# Altium project VCU-BMS_Tester.PrjPCB (part 2 of 2)

## Sheet Connectors.SchDoc
size B; Organization: Altium Limited; Address1: L3, 12a Rodborough Rd; Address2: Frenchs Forest; Address3: NSW; Address4: Australia 2086; SheetNumber: 7
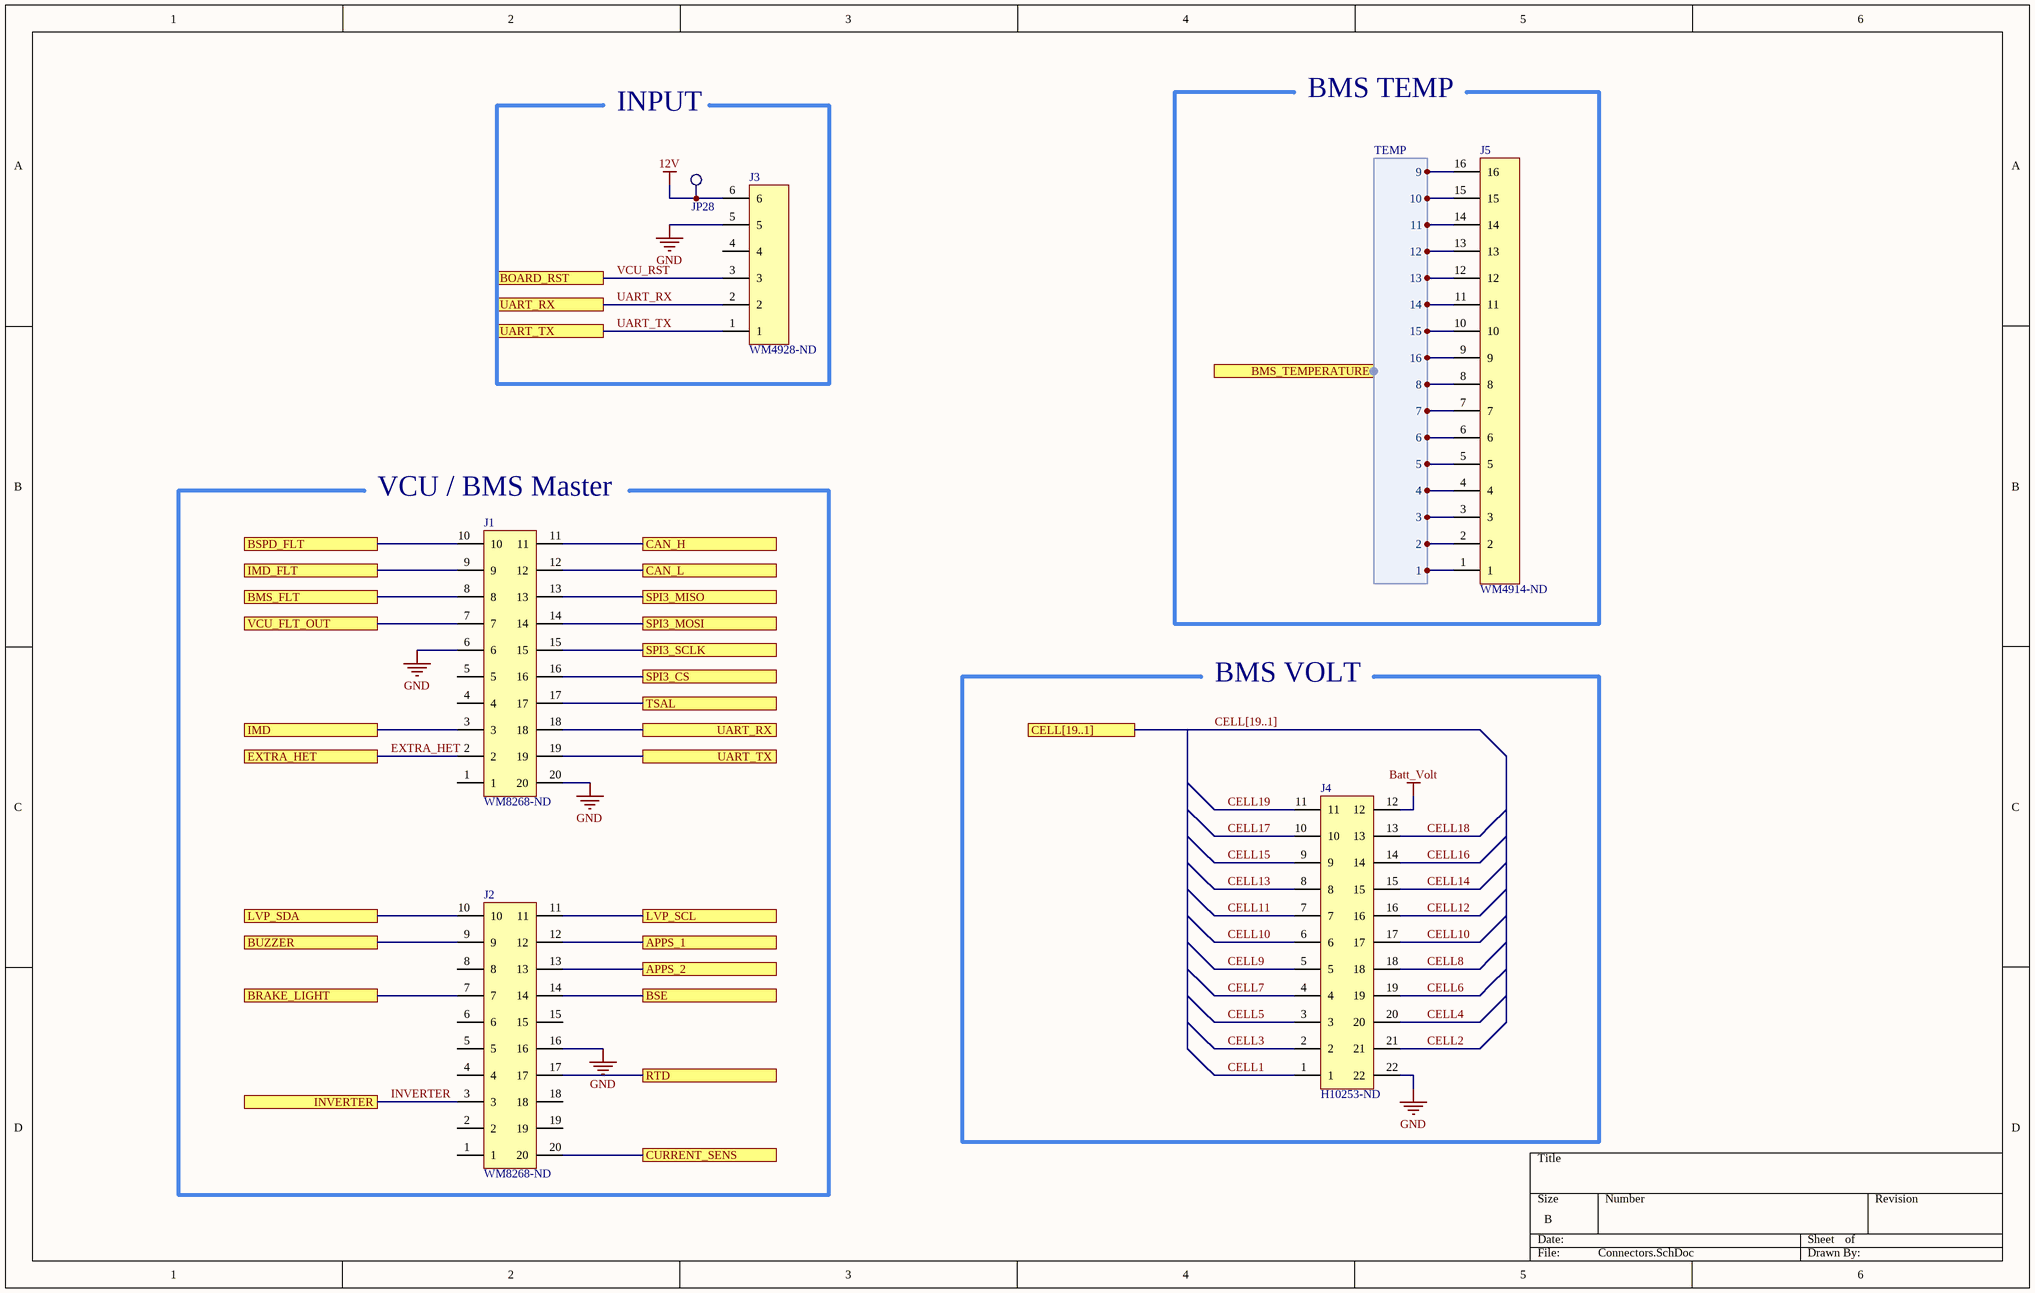
[diagram p4: Connectors.SchDoc]

### Parts
J1  WM8268-ND  [2X10PIN]
J2  WM8268-ND  [2X10PIN]
J3  WM4928-ND  [6PIN]
J4  H10253-ND  [2X11PIN]
J5  WM4914-ND  [16PIN]
JP28  Testpoint2  [TP2]  (value not drawn)

### Ports
APPS_1, APPS_2, BMS_FLT, BMS_TEMPERATURE (harness TEMP), BOARD_RST, BRAKE_LIGHT, BSE, BSPD_FLT, BUZZER, CAN_H, CAN_L, CELL[19..1], CURRENT_SENS, EXTRA_HET, IMD, IMD_FLT, INVERTER, LVP_SCL, LVP_SDA, RTD, SPI3_CS, SPI3_MISO, SPI3_MOSI, SPI3_SCLK, TSAL, UART_RX, UART_TX, VCU_FLT_OUT

### Harnesses
TEMP: 1, 2, 3, 4, 5, 6, 7, 8, 16, 15, 14, 13, 12, 11, 10, 9

### Nets
12V: J3.6 JP28.1
Batt_Volt: J4.12
GND: J1.6 J1.20 J2.16 J3.5 J4.22
APPS_1: J2.12 ; port APPS_1
APPS_2: J2.13 ; port APPS_2
BMS_FLT: J1.8 ; port BMS_FLT
BSE: J2.14 ; port BSE
BSPD_FLT: J1.10 ; port BSPD_FLT
CAN_H: J1.11 ; port CAN_H
CAN_L: J1.12 ; port CAN_L
CELL1: J4.1
CELL2: J4.21
CELL3: J4.2
CELL4: J4.20
CELL5: J4.3
CELL6: J4.19
CELL7: J4.4
CELL8: J4.18
CELL9: J4.5
CELL10: J4.6 J4.17
CELL11: J4.7
CELL12: J4.16
CELL13: J4.8
CELL14: J4.15
CELL15: J4.9
CELL16: J4.14
CELL17: J4.10
CELL18: J4.13
CELL19: J4.11
CURRENT_SENS: J2.20 ; port CURRENT_SENS
EXTRA_HET: J1.2 ; port EXTRA_HET
IMD: J1.3 ; port IMD
IMD_FLT: J1.9 ; port IMD_FLT
INVERTER: J2.3 ; port INVERTER
RTD: J2.17 ; port RTD
SCL: J2.11 ; port LVP_SCL
SDA: J2.10 ; port LVP_SDA
SPI3_CLK: J1.15 ; port SPI3_SCLK
SPI3_CS: J1.16 ; port SPI3_CS
SPI3_MISO: J1.13 ; port SPI3_MISO
SPI3_MOSI: J1.14 ; port SPI3_MOSI
TEMP_1: J5.1 ; port BMS_TEMPERATURE.1
TEMP_2: J5.2 ; port BMS_TEMPERATURE.2
TEMP_3: J5.3 ; port BMS_TEMPERATURE.3
TEMP_4: J5.4 ; port BMS_TEMPERATURE.4
TEMP_5: J5.5 ; port BMS_TEMPERATURE.5
TEMP_6: J5.6 ; port BMS_TEMPERATURE.6
TEMP_7: J5.7 ; port BMS_TEMPERATURE.7
TEMP_8: J5.8 ; port BMS_TEMPERATURE.8
TEMP_9: J5.16 ; port BMS_TEMPERATURE.9
TEMP_10: J5.15 ; port BMS_TEMPERATURE.10
TEMP_11: J5.14 ; port BMS_TEMPERATURE.11
TEMP_12: J5.13 ; port BMS_TEMPERATURE.12
TEMP_13: J5.12 ; port BMS_TEMPERATURE.13
TEMP_14: J5.11 ; port BMS_TEMPERATURE.14
TEMP_15: J5.10 ; port BMS_TEMPERATURE.15
TEMP_16: J5.9 ; port BMS_TEMPERATURE.16
TSAL: J1.17 ; port TSAL
UART_RX: J1.18 J3.2 ; port UART_RX
UART_TX: J1.19 J3.1 ; port UART_TX
VCU_FLT_OUT: J1.7 ; port VCU_FLT_OUT
VCU_RST: J3.3 ; port BOARD_RST
NetJ2_7: J2.7 ; port BRAKE_LIGHT
NetJ2_9: J2.9 ; port BUZZER

Not connected (* = marked no-connect by the designer): J1 1 4 5; J2 1 2 4 5 6 8 15 18 19; J3 4

### Buses and harness runs
bus CELL[19..1] = port CELL[19..1]

### Notes on the sheet
- BMS TEMP
- INPUT
- (near J1) VCU / BMS Master
- BMS VOLT
- Title
- Size:
- Date:
- B
- Number:
- Time:
- Revision:
- Sheet
- of
- File:

### Library data of the parts
J1 J2 = 2X10PIN: CONN HEADER R/A 20POS 2.54MM; Manufacturer: Molex; Manufacturer Part Number: 0901303120; Max Voltage Rating (DC): 350V; Supplier 1: Digi-Key; Stock 1: 2147; Pricing 1: 1=2.41, 10=2.19, 100=1.877, 500=1.56416, 1000=1.3407, 5000=1.18875, 10000=1.16194 (USD); Housing Color: Black; Housing Material: Polyester; Contact Plating: Tin,Lead; Contact Material: Brass; Min Operating Temperature: -55°C; Max Operating Temperature: 125°C; Number of Rows: 2; Packaging: Tray; Termination: Solder; Orientation: Right Angle; Max Voltage Rating (AC): 350V; Length: 28.12mm; Pitch: 2.54mm; Depth: 9.75mm; Supplier Part Number 1: WM8268-ND
J3 = 6PIN: CONN HEADER R/A 6POS 2.54MM; Manufacturer: Molex; Manufacturer Part Number: 70553-0040; Contact Resistance: 30mR; Number of Positions: 6; Current Rating: 3A; Voltage Rating: 250V; Gender: Male; Insulation Resistance: 1GR; Glow Wire Compliant: Non-compliant; Supplier 1: Digi-Key; Stock 1: 2212; Pricing 1: 1=1.58, 10=1.434, 100=1.2289, 500=1.0241, 1000=0.8778, 5000=0.77832, 10000=0.76076 (USD); Mount: Through Hole; Contact Material: Bronze,Copper Alloy,Brass; Contact Plating: Tin; Housing Color: Black; Color: Black; Housing Material: Thermoplastic; Material: Brass; Min Operating Temperature: -40°C; Max Operating Temperature: 105°C; Number of Rows: 1; Packaging: Rail/Tube; Termination: Solder; Number of Contacts: 6; Orientation: Right Angle; Package Quantity: 1200; Max Current Rating: 3A; Max Voltage Rating (AC): 250V; Voltage Rating (DC): 250V; Number of Circuits: 6; Length: 17.79mm; Height: 6.99mm; Pitch: 2.54mm; Depth: 13.59mm; Radiation Hardening: No; REACH SVHC: Unknown; ELV: Compliant; Lead Free: Lead Free; Flammability Rating: UL94 V-0; ComponentLink1URL: http://uk.rs-online.com/webdocs/13c4/0900766b813c4993.pdf?src-supplier=RSComponents; ComponentLink1Description: http://uk.rs-online.com/webdocs/13c4/0900766b813c4993.pdf?src-supplier=RSComponents; ComponentLink2URL: http://www.molex.com/webdocs/datasheets/pdf/en-us/0705530040_PCB_HEADERS.pdf?src-supplier=Avnet+Europe; ComponentLink2Description: http://www.molex.com/webdocs/datasheets/pdf/en-us/0705530040_PCB_HEADERS.pdf?src-supplier=Avnet+Europe; ComponentLink3URL: http://www.farnell.com/datasheets/1844551.pdf?src-supplier=Farnell; ComponentLink3Description: http://www.farnell.com/datasheets/1844551.pdf?src-supplier=Farnell; ComponentLink4URL: http://www.mouser.com/ds/2/276/0705530040_PCB_HEADERS-172948.pdf?src-supplier=Mouser; ComponentLink4Description: http://www.mouser.com/ds/2/276/0705530040_PCB_HEADERS-172948.pdf?src-supplier=Mouser; ComponentLink5URL: http://www.farnell.com/cad/655744.pdf?src-supplier=Element14; ComponentLink5Description: http://www.farnell.com/cad/655744.pdf?src-supplier=Element14; ComponentLink6URL: http://www.jameco.com/Jameco/Products/ProdDS/1302975.pdf?src-supplier=Jameco; ComponentLink6Description: http://www.jameco.com/Jameco/Products/ProdDS/1302975.pdf?src-supplier=Jameco; Supplier Part Number 1: WM4928-ND
J4 = 2X11PIN: CONN HEADER R/A 22POS 2MM; Manufacturer: Hirose; Manufacturer Part Number: DF11-22DP-2DS(24); Number of Positions: 22; Connector Type: Male Pin; Gender: Male; Current Rating: 2A; Voltage Rating: 250V; Contact Resistance: 30mR; Row Spacing: 0.079inch; Supplier 1: Digi-Key; Stock 1: 2198; Pricing 1: 1=1.19, 10=1.046, 100=0.902, 500=0.738, 1000=0.656, 5000=0.574, 10000=0.5453 (USD); Mount: Through Hole; Contact Material: Brass,Copper Alloy,Tin; Color: Black; Contact Plating: Tin; Housing Color: Black; Housing Material: Polyamide; Min Operating Temperature: -30°C; Max Operating Temperature: 85°C; Number of Rows: 2; Packaging: Rail/Tube; Package Quantity: 20; Termination: Solder; Number of Contacts: 22; Orientation: Right Angle; Max Current Rating: 2A; Fastening Type: Detent; Length: 24mm; Height: 5mm; Pitch: 2mm; Depth: 10mm; Contact Mating Length: 0.118inch; Radiation Hardening: No; Lead Free: Lead Free; ComponentLink1URL: http://docs-usa.electrocomponents.com/techlib:/itc_doclist_US.htm?stockno=6888963&src-supplier=Allied+Electronics; ComponentLink1Description: http://docs-usa.electrocomponents.com/techlib:/itc_doclist_US.htm?stockno=6888963&src-supplier=Allied+Electronics; ComponentLink2URL: https://www.verical.com/server-webapp/html/getDatasheet?partID=456315&src-supplier=Verical; ComponentLink2Description: https://www.verical.com/server-webapp/html/getDatasheet?partID=456315&src-supplier=Verical; ComponentLink3URL: http://www.hirose.co.jp/cataloge_hp/en_DF11_20130411.pdf?src-supplier=Future+Electronics; ComponentLink3Description: http://www.hirose.co.jp/cataloge_hp/en_DF11_20130411.pdf?src-supplier=Future+Electronics; ComponentLink4URL: http://www.farnell.com/datasheets/91550.pdf?src-supplier=Element14; ComponentLink4Description: http://www.farnell.com/datasheets/91550.pdf?src-supplier=Element14; ComponentLink5URL: http://www.mouser.com/ds/2/185/DF11_catalog-1064296.pdf?src-supplier=Mouser; ComponentLink5Description: http://www.mouser.com/ds/2/185/DF11_catalog-1064296.pdf?src-supplier=Mouser; ComponentLink6URL: http://documents.rs-components.com/techlib://itc_doclist_GB.htm?stockno=6056598&src-supplier=RSComponents; ComponentLink6Description: http://documents.rs-components.com/techlib://itc_doclist_GB.htm?stockno=6056598&src-supplier=RSComponents; Supplier Part Number 1: H10253-ND
J5 = 16PIN: CONN HEADER R/A 16POS 2.54MM; Manufacturer: Molex; Manufacturer Part Number: 0705530015; Number of Positions: 16; Connector Type: Male Pin; Contact Resistance: 30mR; Pitch: 0.1inch; Supplier 1: Digi-Key; Stock 1: 225; Pricing 1: 1=8.86, 10=8.47, 100=7.1225, 500=5.9675, 1000=5.2745 (USD); Mount: Through Hole; Housing Material: Polyester; Contact Plating: Gold; Contact Material: Bronze; Color: Black; Housing Color: Black; Min Operating Temperature: -40°C; Max Operating Temperature: 105°C; Packaging: Rail/Tube; Number of Rows: 1; Termination: Solder; Orientation: Right Angle; Length: 43.19mm; Depth: 13.59mm; Contact Mating Length: 0.24inch; Radiation Hardening: No; ComponentLink1URL: http://www.molex.com/pdm_docs/sd/705530015_sd.pdf?src-supplier=Digi-Key; ComponentLink1Description: http://www.molex.com/pdm_docs/sd/705530015_sd.pdf?src-supplier=Digi-Key; ComponentLink2URL: http://www.molex.com/webdocs/datasheets/pdf/en-us/0705530015_PCB_HEADERS.pdf?src-supplier=Avnet; ComponentLink2Description: http://www.molex.com/webdocs/datasheets/pdf/en-us/0705530015_PCB_HEADERS.pdf?src-supplier=Avnet; Supplier Part Number 1: WM4914-ND
JP28 = Testpoint2: Single layer pad TP

## Sheet BMS_Temp.SchDoc
size A4; Organization: Altium Limited; Address1: L3, 12a Rodborough Rd; Address2: Frenchs Forest; Address3: NSW; Address4: Australia 2086; SheetNumber: 6
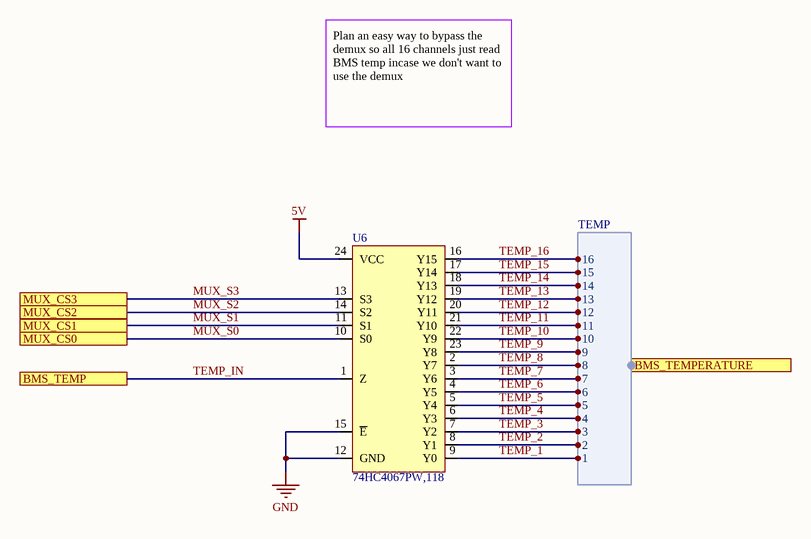
[diagram p5: BMS_Temp.SchDoc]

### Parts
U6  74HC4067PW,118  [24-TSSOP]

### Ports
BMS_TEMP, BMS_TEMPERATURE (harness TEMP), MUX_CS0, MUX_CS1, MUX_CS2, MUX_CS3

### Harnesses
TEMP: 1, 2, 3, 4, 5, 6, 7, 8, 9, 10, 11, 12, 13, 14, 15, 16

### Nets
5V: U6.24(VCC)
GND: U6.12(GND) U6.15(~{E})
MUX_S0: U6.10(S0) ; port MUX_CS0
MUX_S1: U6.11(S1) ; port MUX_CS1
MUX_S2: U6.14(S2) ; port MUX_CS2
MUX_S3: U6.13(S3) ; port MUX_CS3
TEMP_1: U6.9(Y0) ; port BMS_TEMPERATURE.1
TEMP_2: U6.8(Y1) ; port BMS_TEMPERATURE.2
TEMP_3: U6.7(Y2) ; port BMS_TEMPERATURE.3
TEMP_4: U6.6(Y3) ; port BMS_TEMPERATURE.4
TEMP_5: U6.5(Y4) ; port BMS_TEMPERATURE.5
TEMP_6: U6.4(Y5) ; port BMS_TEMPERATURE.6
TEMP_7: U6.3(Y6) ; port BMS_TEMPERATURE.7
TEMP_8: U6.2(Y7) ; port BMS_TEMPERATURE.8
TEMP_9: U6.23(Y8) ; port BMS_TEMPERATURE.9
TEMP_10: U6.22(Y9) ; port BMS_TEMPERATURE.10
TEMP_11: U6.21(Y10) ; port BMS_TEMPERATURE.11
TEMP_12: U6.20(Y11) ; port BMS_TEMPERATURE.12
TEMP_13: U6.19(Y12) ; port BMS_TEMPERATURE.13
TEMP_14: U6.18(Y13) ; port BMS_TEMPERATURE.14
TEMP_15: U6.17(Y14) ; port BMS_TEMPERATURE.15
TEMP_16: U6.16(Y15) ; port BMS_TEMPERATURE.16
TEMP_IN: U6.1(Z) ; port BMS_TEMP  [project net BMS_TEMP]

### Notes on the sheet
- Plan an easy way to bypass the demux so all 16 channels just read BMS temp incase we don't want to use the demux
- Title
- Size:
- Date:
- B
- Number:
- Time:
- Revision:
- Sheet
- of
- File:

### Library data of the parts
U6 = MUX-74HC4067: IC MUX/DEMUX 1X16 24TSSOP; Manufacturer: Nexperia USA; Supplier 1: Digi-Key; Manufacturer Part Number: 74HC4067PW,118; Stock 1: 7949; Pricing 1: 1=0.87, 10=0.779, 25=0.7392, 100=0.6072, 250=0.5676, 500=0.5016, 1000=0.396 (USD); ComponentLink1URL: https://assets.nexperia.com/documents/data-sheet/74HC_HCT4067.pdf?src-supplier=Digi-Key; ComponentLink1Description: https://assets.nexperia.com/documents/data-sheet/74HC_HCT4067.pdf?src-supplier=Digi-Key; Supplier Part Number 1: 1727-2042-6-ND

## Sheet BMS_Voltage.SchDoc
size A4; Organization: Altium Limited; Address1: L3, 12a Rodborough Rd; Address2: Frenchs Forest; Address3: NSW; Address4: Australia 2086; SheetNumber: 5
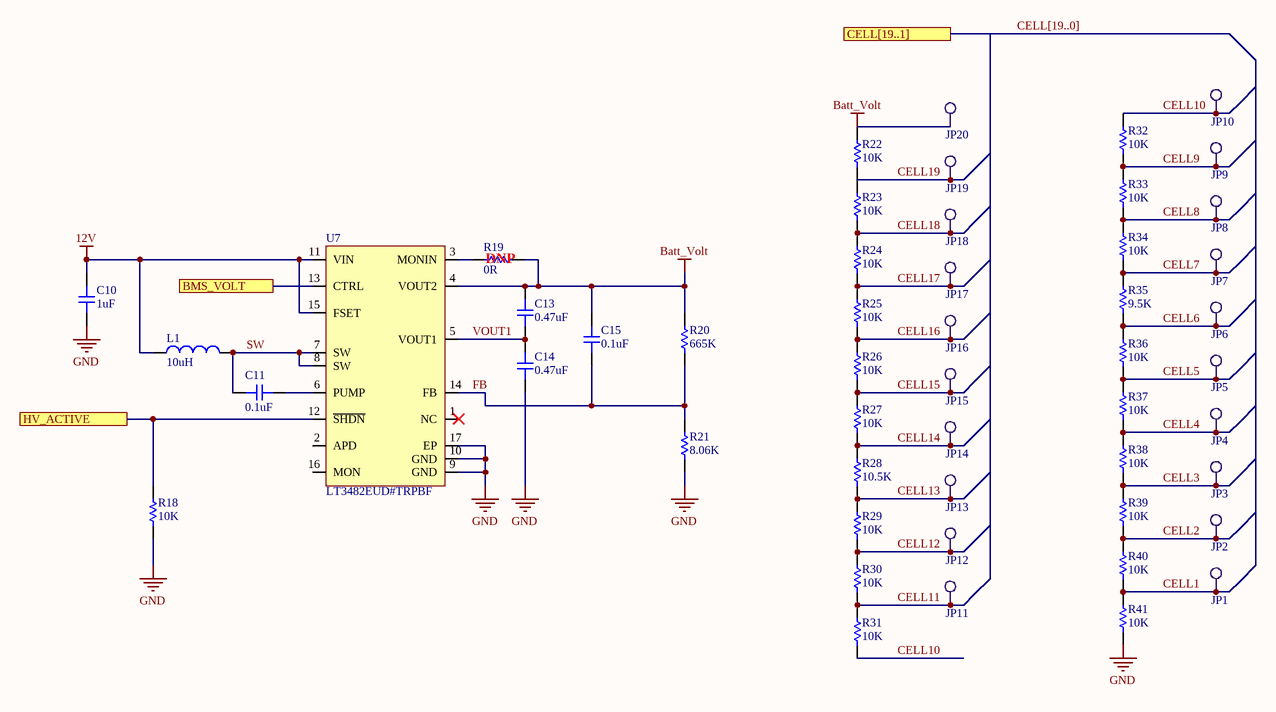
[diagram p6: BMS_Voltage.SchDoc]

### Parts
C10  1uF  [CAP-0603]
C11  0.1uF  [CAP-1206]
C13  0.47uF  [CAP-0805]
C14  0.47uF  [CAP-0805]
C15  0.1uF  [CAP-1206]
JP1  Testpoint2  [TP2]  (value not drawn)
JP2  Testpoint2  [TP2]  (value not drawn)
JP3  Testpoint2  [TP2]  (value not drawn)
JP4  Testpoint2  [TP2]  (value not drawn)
JP5  Testpoint2  [TP2]  (value not drawn)
JP6  Testpoint2  [TP2]  (value not drawn)
JP7  Testpoint2  [TP2]  (value not drawn)
JP8  Testpoint2  [TP2]  (value not drawn)
JP9  Testpoint2  [TP2]  (value not drawn)
JP10  Testpoint2  [TP2]  (value not drawn)
JP11  Testpoint2  [TP2]  (value not drawn)
JP12  Testpoint2  [TP2]  (value not drawn)
JP13  Testpoint2  [TP2]  (value not drawn)
JP14  Testpoint2  [TP2]  (value not drawn)
JP15  Testpoint2  [TP2]  (value not drawn)
JP16  Testpoint2  [TP2]  (value not drawn)
JP17  Testpoint2  [TP2]  (value not drawn)
JP18  Testpoint2  [TP2]  (value not drawn)
JP19  Testpoint2  [TP2]  (value not drawn)
JP20  Testpoint2  [TP2]  (value not drawn)
L1  10uH  [IND-3.2x2.5x2.2]
R18  10K  [RES-0603]
R19  0R  [RES-0603]
R20  665K  [RES-0603]
R21  8.06K  [RES-0603]
R22  10K  [RES-0603]
R23  10K  [RES-0603]
R24  10K  [RES-0603]
R25  10K  [RES-0603]
R26  10K  [RES-0603]
R27  10K  [RES-0603]
R28  10.5K  [RES-0603]
R29  10K  [RES-0603]
R30  10K  [RES-0603]
R31  10K  [RES-0603]
R32  10K  [RES-0603]
R33  10K  [RES-0603]
R34  10K  [RES-0603]
R35  9.5K  [RES-0603]
R36  10K  [RES-0603]
R37  10K  [RES-0603]
R38  10K  [RES-0603]
R39  10K  [RES-0603]
R40  10K  [RES-0603]
R41  10K  [RES-0603]
U7  LT3482EUD#TRPBF  [QFN-16 (3x3mm)]

### Ports
BMS_VOLT, CELL[19..1], HV_ACTIVE

### Nets
12V: C10.2 L1.1 U7.11(VIN) U7.15(FSET)
Batt_Volt: C13.2 C15.2 JP20.1 R19.2 R20.2 R22.2 U7.4(VOUT2)
GND: C10.1 C14.1 R18.1 R21.1 R41.1 U7.9(GND) U7.10(GND) U7.17(EP)
BMS_VOLT: U7.13(CTRL) ; port BMS_VOLT
CELL1: JP1.1 R40.1 R41.2
CELL2: JP2.1 R39.1 R40.2
CELL3: JP3.1 R38.1 R39.2
CELL4: JP4.1 R37.1 R38.2
CELL5: JP5.1 R36.1 R37.2
CELL6: JP6.1 R35.1 R36.2
CELL7: JP7.1 R34.1 R35.2
CELL8: JP8.1 R33.1 R34.2
CELL9: JP9.1 R32.1 R33.2
CELL10: JP10.1 R31.1 R32.2
CELL11: JP11.1 R30.1 R31.2
CELL12: JP12.1 R29.1 R30.2
CELL13: JP13.1 R28.1 R29.2
CELL14: JP14.1 R27.1 R28.2
CELL15: JP15.1 R26.1 R27.2
CELL16: JP16.1 R25.1 R26.2
CELL17: JP17.1 R24.1 R25.2
CELL18: JP18.1 R23.1 R24.2
CELL19: JP19.1 R22.1 R23.2
FB: C15.1 R20.1 R21.2 U7.14(FB)
HV_ACTIVE: R18.2 U7.12(~{SHDN}) ; port HV_ACTIVE
SW: C11.2 L1.2 U7.7(SW) U7.8(SW)
VOUT1: C13.1 C14.2 U7.5(VOUT1)
NetC11_1: C11.1 U7.6(PUMP)
NetR19_1: R19.1 U7.3(MONIN)

Not connected (* = marked no-connect by the designer): U7 1(NC)* 2(APD) 16(MON)

### Buses and harness runs
bus CELL[19..0] = port CELL[19..1]

### Notes on the sheet
- (near R19) DNP
- Title
- Size:
- Date:
- Tabloid
- Number:
- Time:
- Revision:
- Sheet
- of
- File:

### Library data of the parts
C10 = 0603-1uF-16V: CAP CER 1UF 16V X7R 0603; Manufacturer: KEMET; Manufacturer Part Number: C0603C105K4RACTU; Dielectric Material: Ceramic; Tolerance: 10%; Dissipation Factor: 3.5%; Supplier 1: Digi-Key; Stock 1: 600463; Pricing 1: 1=0.12, 10=0.088, 100=0.0391, 500=0.02792, 1000=0.02193 (USD); Mount: Surface Mount,PCB; Case/Package: 0603; Number of Pins: 2; Case Code (Metric): 1608; Case Code (Imperial): 0603; Contact Plating: Tin,Matte; Min Operating Temperature: -55°C; Max Operating Temperature: 125°C; Package Quantity: 4000; Capacitance: 1uF; Voltage Rating: 16V; Packaging: Tape and Reel; Voltage Rating (DC): 16V; Dielectric: X7R; Termination: SMD/SMT; Voltage: 16V; Length: 1.6mm; Height: 0.8mm; Width: 0.031inch; Thickness: 0.034inch; Depth: 0.8mm; Radiation Hardening: No; REACH SVHC: No SVHC; ComponentLink1URL: http://www.mouser.com/ds/2/212/KEM_C1002_X7R_SMD-1102033.pdf?src-supplier=Mouser; ComponentLink1Description: http://www.mouser.com/ds/2/212/KEM_C1002_X7R_SMD-1102033.pdf?src-supplier=Mouser; ComponentLink2URL: http://www.kemet.com/kemet/web/homepage/kechome.nsf/file/Commercial%20Ceramic%20Chips%20X7R%20Dielectric/$file/KEM_C1002_X7R_SMD.pdf?src-supplier=Element14; ComponentLink2Description: http://www.kemet.com/kemet/web/homepage/kechome.nsf/file/Commercial%20Ceramic%20Chips%20X7R%20Dielectric/$file/KEM_C1002_X7R_SMD.pdf?src-supplier=Element14; ComponentLink3URL: https://www.verical.com/server-webapp/html/getDatasheet?partID=385479&src-supplier=Verical; ComponentLink3Description: https://www.verical.com/server-webapp/html/getDatasheet?partID=385479&src-supplier=Verical; ComponentLink4URL: http://www.kemet.com/kemet/web/homepage/kechome.nsf/vapubfiles/KEM_C1002_X7R_SMD.pdf/$file/KEM_C1002_X7R_SMD.pdf?src-supplier=Element14; ComponentLink4Description: http://www.kemet.com/kemet/web/homepage/kechome.nsf/vapubfiles/KEM_C1002_X7R_SMD.pdf/$file/KEM_C1002_X7R_SMD.pdf?src-supplier=Element14; Supplier Part Number 1: 399-7847-6-ND
C11 C15 = 1206-0.1uF-100V: CAP CER 0.1UF 100V X7R 1206; Manufacturer: KEMET; Manufacturer Part Number: C1206C104K1RACTU; Dielectric Material: Ceramic; Capacitance: 100nF; Tolerance: 10%; Supplier 1: Digi-Key; Stock 1: 407754; Pricing 1: 1=0.28, 10=0.19, 100=0.1075, 500=0.0759, 1000=0.06641 (USD); Mount: Surface Mount,PCB; Case/Package: 1206; Number of Pins: 2; Case Code (Imperial): 1206; Case Code (Metric): 3216; Contact Plating: Tin,Matte; Min Operating Temperature: -55°C; Max Operating Temperature: 125°C; Packaging: Tape and Reel; Package Quantity: 1; Voltage Rating: 100V; Voltage Rating (DC): 100V; Dielectric: X7R; Termination: SMD/SMT; Voltage: 100V; Length: 3.2mm; Height: 0.78mm; Width: 1.6mm; Thickness: 0.035inch; Depth: 1.6mm; Radiation Hardening: No; REACH SVHC: No SVHC; ComponentLink1URL: http://www.farnell.com/datasheets/2740715.pdf?src-supplier=Element14; ComponentLink1Description: http://www.farnell.com/datasheets/2740715.pdf?src-supplier=Element14; ComponentLink2URL: https://search.kemet.com/component-edge/download/datasheet/C1206C104K1RACTU.pdf?src-supplier=Allied+Electronics; ComponentLink2Description: https://search.kemet.com/component-edge/download/datasheet/C1206C104K1RACTU.pdf?src-supplier=Allied+Electronics; Supplier Part Number 1: 399-1805-6-ND
C13 C14 = 0805-0.47uF-100V: CAP CER 0.47UF 100V X7S 0805; Manufacturer: TDK; Manufacturer Part Number: C2012X7S2A474M125AB; Tolerance: 20%; Capacitance: 470nF; Supplier 1: Digi-Key; Stock 1: 8557; Pricing 1: 1=0.44, 10=0.303, 50=0.2118, 100=0.1815, 500=0.13612, 1000=0.11495 (USD); Mount: Surface Mount; Case/Package: 0805; Number of Pins: 2; Case Code (Metric): 2012; Case Code (Imperial): 0805; Weight: 0.000194oz; Min Operating Temperature: -55°C; Max Operating Temperature: 125°C; Voltage Rating (DC): 100V; Packaging: Tape and Reel; Package Quantity: 1; Voltage Rating: 100V; Dielectric: X7S; Termination: SMD/SMT; Resistor Type: Ceramic; Length: 2mm; Width: 0.049inch; Thickness: 0.057inch; Depth: 1.25mm; ComponentLink1URL: http://www.mouser.com/ds/2/400/lcc_commercial_general_en-837201.pdf?src-supplier=Mouser; ComponentLink1Description: http://www.mouser.com/ds/2/400/lcc_commercial_general_en-837201.pdf?src-supplier=Mouser; Supplier Part Number 1: 445-5204-6-ND
JP1-JP20 = Testpoint2: Single layer pad TP
L1 = 10uH-0.6A: FIXED IND 10UH 600MA 504 MOHM; Manufacturer: TDK; Manufacturer Part Number: NLCV32T-100K-EFRD; Core Material: Ferrite; Shielding: Unshielded; DC Resistance (DCR): 504mR; Self Resonant Frequency: 30MHz; Test Frequency: 2.52MHz; Tolerance: 10%; Supplier 1: Digi-Key; Stock 1: 3400; Pricing 1: 1=0.3, 10=0.264, 25=0.2312, 50=0.198, 100=0.1815, 250=0.165, 500=0.1551, 1000=0.1188 (USD); Mount: Surface Mount; Case/Package: 1210; Min Operating Temperature: -40°C; Max Operating Temperature: 125°C; Packaging: Tape and Reel; Resistor Type: Wirewound; Inductance: 10uH; Current Rating: 600mA; Length: 0.126inch; Width: 0.098inch; Height - Seated (Max): 0.094inch; Ratings: AEC-Q200; ComponentLink1URL: https://product.tdk.com/info/en/catalog/datasheets/inductor_automotive_decoupling_nlcv32-efrd_en.pdf?src-supplier=Digi-Key; ComponentLink1Description: https://product.tdk.com/info/en/catalog/datasheets/inductor_automotive_decoupling_nlcv32-efrd_en.pdf?src-supplier=Digi-Key; ComponentLink2URL: http://www.farnell.com/datasheets/2261959.pdf?src-supplier=Farnell; ComponentLink2Description: http://www.farnell.com/datasheets/2261959.pdf?src-supplier=Farnell; Supplier Part Number 1: 445-175563-6-ND
R18 R22-R27 R29-R34 R36-R41 = 0603-10KR: RES SMD 10K OHM 5% 1/10W 0603; Manufacturer: Yageo; Manufacturer Part Number: RC0603JR-0710KL; Resistance: 10kR; Voltage Rating (DC): 50V; Temperature Coefficient: 100ppm/°C; Power Rating: 100mW; Supplier 1: Digi-Key; Stock 1: 3006558; Pricing 1: 1=0.1, 10=0.019, 100=0.0077, 1000=0.00347, 2500=0.00301 (USD); Case/Package: 0603; Number of Pins: 2; Contact Plating: Tin,Matte; Case Code (Imperial): 0603; Case Code (Metric): 1608; Min Operating Temperature: -55°C; Max Operating Temperature: 155°C; Packaging: Tape and Reel; Tolerance: 5%; Composition: Thick Film; Voltage Rating: 50V; Termination: SMD/SMT; Military Standard: Not; Features: Moisture Resistant; Max Power Dissipation: 100mW; Number of Terminations: 2; Length: 0.063inch; Width: 0.031inch; Depth: 0.8mm; Height - Seated (Max): 0.022inch; Radiation Hardening: No; REACH SVHC: Unknown; Lead Free: Lead Free; ComponentLink1URL: http://www.yageo.com/documents/recent/PYu-RC_Group_51_RoHS_L_10.pdf?src-supplier=Digi-Key; ComponentLink1Description: http://www.yageo.com/documents/recent/PYu-RC_Group_51_RoHS_L_10.pdf?src-supplier=Digi-Key; Supplier Part Number 1: 311-10KGRDKR-ND
R19 = 0603-0R: RES SMD 0 OHM JUMPER 1/10W 0603; Manufacturer: Yageo; Manufacturer Part Number: RC0603JR-070RL; Resistance: 0mR; Tolerance: 1%; Voltage Rating: 50V; Power Rating: 100mW; Temperature Coefficient: 200ppm/°C; Supplier 1: Digi-Key; Stock 1: 25658294; Pricing 1: 1=0.1, 10=0.019, 25=0.0136, 50=0.0104, 100=0.0077, 250=0.00588, 500=0.00472, 1000=0.00347 (USD); Case/Package: 0603; Number of Pins: 2; Case Code (Imperial): 0603; Case Code (Metric): 1608; Contact Plating: Tin,Matte; Min Operating Temperature: -55°C; Max Operating Temperature: 155°C; Package Quantity: 5000; Packaging: Tape and Reel; Voltage Rating (DC): 50V; Termination: SMD/SMT; Composition: Thick Film; Military Standard: Not; Length: 1.6mm; Height: 0.45mm; Width: 0.8mm; Depth: 0.8mm; Radiation Hardening: No; REACH SVHC: No SVHC; Lead Free: Lead Free; ComponentLink1URL: http://www.farnell.com/datasheets/2167052.pdf?src-supplier=Element14; ComponentLink1Description: http://www.farnell.com/datasheets/2167052.pdf?src-supplier=Element14; ComponentLink2URL: https://www.verical.com/server-webapp/html/getDatasheet?partID=329462&src-supplier=Verical; ComponentLink2Description: https://www.verical.com/server-webapp/html/getDatasheet?partID=329462&src-supplier=Verical; ComponentLink3URL: http://www.yageo.com/documents/recent/PYu-RC_Group_51_RoHS_L_9.pdf?src-supplier=Mouser; ComponentLink3Description: http://www.yageo.com/documents/recent/PYu-RC_Group_51_RoHS_L_9.pdf?src-supplier=Mouser; ComponentLink4URL: http://www.farnell.com/datasheets/443971.pdf?src-supplier=Element14; ComponentLink4Description: http://www.farnell.com/datasheets/443971.pdf?src-supplier=Element14; ComponentLink5URL: http://documents.rs-components.com/techlib://itc_doclist_GB.htm?stockno=6515918&src-supplier=RSComponents; ComponentLink5Description: http://documents.rs-components.com/techlib://itc_doclist_GB.htm?stockno=6515918&src-supplier=RSComponents; Supplier Part Number 1: 311-0.0GRCT-ND
R20 = 0603-665KR: RES 665K OHM 1% 1/10W 0603; Manufacturer: Stackpole Electronics; Manufacturer Part Number: RMCF0603FT665K; Resistance: 665kR; Power Rating: 100mW; Temperature Coefficient: 100ppm/°C; Supplier 1: Digi-Key; Stock 1: 14804; Pricing 1: 1=0.1, 10=0.015, 100=0.0059, 1000=0.00265, 2500=0.0023 (USD); Mount: Surface Mount; Case/Package: 0603; Case Code (Metric): 1608; Case Code (Imperial): 0603; Contact Plating: Tin,Matte; Min Operating Temperature: -55°C; Max Operating Temperature: 155°C; Tolerance: 1%; Packaging: Tape and Reel; Resistor Type: Thick Film; Number of Terminations: 2; Max Power Dissipation: 100mW; Features: Automotive AEC-Q200; Length: 0.061inch; Width: 0.031inch; Height: 0.022inch; Radiation Hardening: No; Lead Free: Lead Free; ComponentLink1URL: https://www.seielect.com/Catalog/SEI-RMCF_RMCP.pdf?src-supplier=Digi-Key; ComponentLink1Description: https://www.seielect.com/Catalog/SEI-RMCF_RMCP.pdf?src-supplier=Digi-Key; ComponentLink2URL: http://www.seielect.com/Catalog/SEI-RMC.pdf?src-supplier=Future+Electronics; ComponentLink2Description: http://www.seielect.com/Catalog/SEI-RMC.pdf?src-supplier=Future+Electronics; ComponentLink3URL: https://www.seielect.com/catalog/SEI-RMCF_RMCP.pdf?src-supplier=Avnet; ComponentLink3Description: https://www.seielect.com/catalog/SEI-RMCF_RMCP.pdf?src-supplier=Avnet; Supplier Part Number 1: RMCF0603FT665KDKR-ND
R21 = 0603-8.06KR: RES SMD 8.06K OHM 1% 1/10W 0603; Manufacturer: Panasonic; Manufacturer Part Number: ERJ-3EKF8061V; Voltage Rating: 75V; Resistance: 8.06kR; Power Rating: 100mW; Temperature Coefficient: 100ppm/°C; Voltage Rating (DC): 50V; Supplier 1: Digi-Key; Stock 1: 296308; Pricing 1: 1=0.1, 10=0.032, 100=0.013, 1000=0.00583, 2500=0.00506 (USD); Mount: Surface Mount; Case/Package: 0603; Case Code (Imperial): 0603; Case Code (Metric): 1608; Contact Plating: Tin; Min Operating Temperature: -55°C; Max Operating Temperature: 155°C; Packaging: Tape and Reel; Tolerance: 1%; Package Quantity: 1; Termination: SMD/SMT; Resistor Type: Thick Film; Number of Terminations: 2; Max Power Dissipation: 100mW; Features: Automotive AEC-Q200; Length: 1.6mm; Width: 0.8mm; Height: 0.022inch; Depth: 0.8mm; Radiation Hardening: No; REACH SVHC: Unknown; Military Standard: Not; Lead Free: Lead Free; ComponentLink1URL: http://industrial.panasonic.com/www-data/pdf/AOA0000/AOA0000CE2.pdf?src-supplier=Avnet; ComponentLink1Description: http://industrial.panasonic.com/www-data/pdf/AOA0000/AOA0000CE2.pdf?src-supplier=Avnet; ComponentLink2URL: https://www.alliedelec.com/m/d/623f45ff1957d936ff56d46fd1c28cac.pdf?src-supplier=Allied+Electronics; ComponentLink2Description: https://www.alliedelec.com/m/d/623f45ff1957d936ff56d46fd1c28cac.pdf?src-supplier=Allied+Electronics; ComponentLink3URL: http://www.farnell.com/datasheets/1678782.pdf?src-supplier=Element14; ComponentLink3Description: http://www.farnell.com/datasheets/1678782.pdf?src-supplier=Element14; ComponentLink4URL: http://www.farnell.com/datasheets/1911175.pdf?src-supplier=Element14; ComponentLink4Description: http://www.farnell.com/datasheets/1911175.pdf?src-supplier=Element14; ComponentLink5URL: http://industrial.panasonic.com/www-data/pdf/AOA0000/AOA0000CE2.pdf?src-supplier=Avnet+Europe; ComponentLink5Description: http://industrial.panasonic.com/www-data/pdf/AOA0000/AOA0000CE2.pdf?src-supplier=Avnet+Europe; ComponentLink6URL: http://www.farnell.com/datasheets/1911175.pdf?src-supplier=Farnell; ComponentLink6Description: http://www.farnell.com/datasheets/1911175.pdf?src-supplier=Farnell; Supplier Part Number 1: P8.06KHDKR-ND
R28 = 0603-10.5KR: RES SMD 10.5KOHM 0.5% 1/10W 0603; Manufacturer: Yageo; Manufacturer Part Number: RT0603DRE0710K5L; Resistance: 10.5kR; Max Power Dissipation: 100mW; Temperature Coefficient: 50ppm/°C; Voltage Rating (DC): 50V; Supplier 1: Digi-Key; Stock 1: 24502; Pricing 1: 1=0.1, 10=0.092, 100=0.0356, 1000=0.01564, 2500=0.01351 (USD); Case/Package: 0603; Case Code (Metric): 1608; Case Code (Imperial): 0603; Min Operating Temperature: -55°C; Max Operating Temperature: 155°C; Package Quantity: 5000; Packaging: Tape and Reel; Tolerance: 0.5%; Resistor Type: Thin Film; Number of Terminations: 2; Features: Moisture Resistant; Length: 0.063inch; Height: 0.022inch; Width: 0.031inch; Lead Free: Lead Free; ComponentLink1URL: http://www.yageo.com/NewPortal/yageodocoutput?fileName=/pdf/R-Chip/PYu-RT_1-to-0.05_RoHS_L_5.pdf&src-supplier=Digi-Key; ComponentLink1Description: http://www.yageo.com/NewPortal/yageodocoutput?fileName=/pdf/R-Chip/PYu-RT_1-to-0.05_RoHS_L_5.pdf&src-supplier=Digi-Key; Supplier Part Number 1: 311-2399-6-ND
R35 = 0603-9.5KR: RES SMD 9.53K OHM 1% 1/10W 0603; Manufacturer: Yageo; Manufacturer Part Number: RC0603FR-0795K3L; Resistance: 95.3kR; Voltage Rating (DC): 50V; Power Rating: 100mW; Temperature Coefficient: 100ppm/°C; Working Voltage: 75V; Supplier 1: Digi-Key; Stock 1: 131701; Pricing 1: 1=0.1, 10=0.021, 100=0.0085, 1000=0.00382, 2500=0.00331 (USD); Case/Package: 0603; Case Code (Imperial): 0603; Case Code (Metric): 1608; Min Operating Temperature: -55°C; Max Operating Temperature: 155°C; Tolerance: 1%; Packaging: Tape and Reel; Voltage Rating: 50V; Package Quantity: 5000; Termination: SMD/SMT; Resistor Type: Thick Film; Features: Moisture Resistant; Number of Terminations: 2; Max Power Dissipation: 100mW; Length: 0.063inch; Height: 0.022inch; Width: 0.031inch; Depth: 0.8mm; Lead Free: Lead Free; Military Standard: Not; Supplier Part Number 1: 311-95.3KHRDKR-ND
U7 = Boost Adj-280mA: IC REG BOOST ADJ 280MA 16QFN; Manufacturer: Analog Devices / Linear Technology; Output Voltage: 90V; Min Input Voltage: 2.5V; Number of Outputs: 1; Switching Frequency: 1.1MHz; Synchronous Rectifier: No; Output Type: Adjustable; Supplier 1: Digi-Key; Manufacturer Part Number: LT3482EUD#TRPBF; Stock 1: 2233; Pricing 1: 1=8.73, 25=4.8284 (USD); Case/Package: QFN EP; Number of Pins: 16; Min Operating Temperature: -40°C; Max Operating Temperature: 85°C; Output Current: 280mA; Package Quantity: 2500; Packaging: Tape and Reel; Lead Free: Lead Free; ComponentLink1URL: http://www.linear.com/docs/18598?src-supplier=Digi-Key; ComponentLink1Description: http://www.linear.com/docs/18598?src-supplier=Digi-Key; ComponentLink2URL: http://datasheet.iiic.cc/linear_technology/LT3482EUD_TRPBF.pdf?src-supplier=IIIC; ComponentLink2Description: http://datasheet.iiic.cc/linear_technology/LT3482EUD_TRPBF.pdf?src-supplier=IIIC; Supplier Part Number 1: LT3482EUD#TRPBFDKR-ND

## Nets that join several sheets
3V3: CAN (U5.5), Launchpad (U1.3 U1.53)
5V: CAN (U5.3), Launchpad (R43.2 U1.1 U1.51), DAC (10 pins), BMS_Temp (U6.24)
12V: Launchpad (R42.2), Connectors (J3.6 JP28.1), BMS_Voltage (C10.2 L1.1 U7.11 U7.15)
Batt_Volt: Connectors (J4.12), BMS_Voltage (7 pins)
GND: CAN (U5.2 U5.8), Launchpad (21 pins), DAC (24 pins), Connectors (5 pins), BMS_Temp (U6.12 U6.15), BMS_Voltage (8 pins)
APPS_1: DAC (C7.2 JP25.1 R14.2 U3.5), Connectors (J2.12)
APPS_2: DAC (C6.1 JP24.1 R13.1 U3.4), Connectors (J2.13)
BMS_FLT: Launchpad (U1.69), Connectors (J1.8)
BMS_TEMP: DAC (C9.2 JP27.1 R16.2 U4.5), BMS_Temp (U6.1)
BMS_VOLT: DAC (C8.1 JP26.1 R15.1 U4.4), BMS_Voltage (U7.13)
BSE: DAC (C5.2 JP23.1 R12.2 U2.5), Connectors (J2.14)
BSPD_FLT: Launchpad (U1.79), Connectors (J1.10)
CAN_H: CAN (JP29.1 JP?.1 U5.7), Connectors (J1.11)
CAN_L: CAN (R17.1 R?#1.1 U5.6), Connectors (J1.12)
CAN_RX: CAN (U5.4), Launchpad (U1.38)
CAN_TX: CAN (U5.1), Launchpad (U1.39)
CELL1: Connectors (J4.1), BMS_Voltage (JP1.1 R40.1 R41.2)
CELL2: Connectors (J4.21), BMS_Voltage (JP2.1 R39.1 R40.2)
CELL3: Connectors (J4.2), BMS_Voltage (JP3.1 R38.1 R39.2)
CELL4: Connectors (J4.20), BMS_Voltage (JP4.1 R37.1 R38.2)
CELL5: Connectors (J4.3), BMS_Voltage (JP5.1 R36.1 R37.2)
CELL6: Connectors (J4.19), BMS_Voltage (JP6.1 R35.1 R36.2)
CELL7: Connectors (J4.4), BMS_Voltage (JP7.1 R34.1 R35.2)
CELL8: Connectors (J4.18), BMS_Voltage (JP8.1 R33.1 R34.2)
CELL9: Connectors (J4.5), BMS_Voltage (JP9.1 R32.1 R33.2)
CELL10: Connectors (J4.6 J4.17), BMS_Voltage (JP10.1 R31.1 R32.2)
CELL11: Connectors (J4.7), BMS_Voltage (JP11.1 R30.1 R31.2)
CELL12: Connectors (J4.16), BMS_Voltage (JP12.1 R29.1 R30.2)
CELL13: Connectors (J4.8), BMS_Voltage (JP13.1 R28.1 R29.2)
CELL14: Connectors (J4.15), BMS_Voltage (JP14.1 R27.1 R28.2)
CELL15: Connectors (J4.9), BMS_Voltage (JP15.1 R26.1 R27.2)
CELL16: Connectors (J4.14), BMS_Voltage (JP16.1 R25.1 R26.2)
CELL17: Connectors (J4.10), BMS_Voltage (JP17.1 R24.1 R25.2)
CELL18: Connectors (J4.13), BMS_Voltage (JP18.1 R23.1 R24.2)
CELL19: Connectors (J4.11), BMS_Voltage (JP19.1 R22.1 R23.2)
CURRENT_SENS: DAC (C4.1 JP22.1 R11.1 U2.4), Connectors (J2.20)
EXTRA_HET: Launchpad (U1.36), Connectors (J1.2)
HV_ACTIVE: Launchpad (R47.2 U1.15), BMS_Voltage (R18.2 U7.12)
IMD: Launchpad (U1.77), Connectors (J1.3)
IMD_FLT: Launchpad (U1.68), Connectors (J1.9)
INVERTER: Launchpad (U1.41), Connectors (J2.3)
MIBSPI1 CLK: Launchpad (U1.32), DAC (U2.9 U3.9 U4.9)
MIBSPI1 MISO: Launchpad (U1.33), DAC (6 pins)
MIBSPI1 MOSI: Launchpad (U1.35), DAC (U2.10 U3.10 U4.10)
MIBSPI1 NCS_1: Launchpad (U1.11), DAC (U3.2)
MIBSPI1 NCS_2: Launchpad (U1.81), DAC (U4.2)
MIBSPI1 NCS_5: Launchpad (U1.37), DAC (U2.2)
MUX_S0: Launchpad (U1.6), BMS_Temp (U6.10)
MUX_S1: Launchpad (U1.5), BMS_Temp (U6.11)
MUX_S2: Launchpad (U1.8), BMS_Temp (U6.14)
MUX_S3: Launchpad (U1.7), BMS_Temp (U6.13)
NetJ2_7: Launchpad (R3.2), Connectors (J2.7)
NetJ2_9: Launchpad (R4.2), Connectors (J2.9)
RTD: Launchpad (U1.62), Connectors (J2.17)
SCL: Launchpad (U1.58), Connectors (J2.11)
SDA: Launchpad (U1.59), Connectors (J2.10)
SPI3_CLK: Launchpad (U1.88), Connectors (J1.15)
SPI3_CS: Launchpad (U1.90), Connectors (J1.16)
SPI3_MISO: Launchpad (U1.86), Connectors (J1.13)
SPI3_MOSI: Launchpad (U1.87), Connectors (J1.14)
TEMP_1: Connectors (J5.1), BMS_Temp (U6.9)
TEMP_2: Connectors (J5.2), BMS_Temp (U6.8)
TEMP_3: Connectors (J5.3), BMS_Temp (U6.7)
TEMP_4: Connectors (J5.4), BMS_Temp (U6.6)
TEMP_5: Connectors (J5.5), BMS_Temp (U6.5)
TEMP_6: Connectors (J5.6), BMS_Temp (U6.4)
TEMP_7: Connectors (J5.7), BMS_Temp (U6.3)
TEMP_8: Connectors (J5.8), BMS_Temp (U6.2)
TEMP_9: Connectors (J5.16), BMS_Temp (U6.23)
TEMP_10: Connectors (J5.15), BMS_Temp (U6.22)
TEMP_11: Connectors (J5.14), BMS_Temp (U6.21)
TEMP_12: Connectors (J5.13), BMS_Temp (U6.20)
TEMP_13: Connectors (J5.12), BMS_Temp (U6.19)
TEMP_14: Connectors (J5.11), BMS_Temp (U6.18)
TEMP_15: Connectors (J5.10), BMS_Temp (U6.17)
TEMP_16: Connectors (J5.9), BMS_Temp (U6.16)
TSAL: Launchpad (U1.66), Connectors (J1.17)
UART_RX: Launchpad (U1.83), Connectors (J1.18 J3.2)
UART_TX: Launchpad (U1.84), Connectors (J1.19 J3.1)
VCU_FLT_OUT: Launchpad (U1.85), Connectors (J1.7)
VCU_RST: Launchpad (U1.60), Connectors (J3.3)